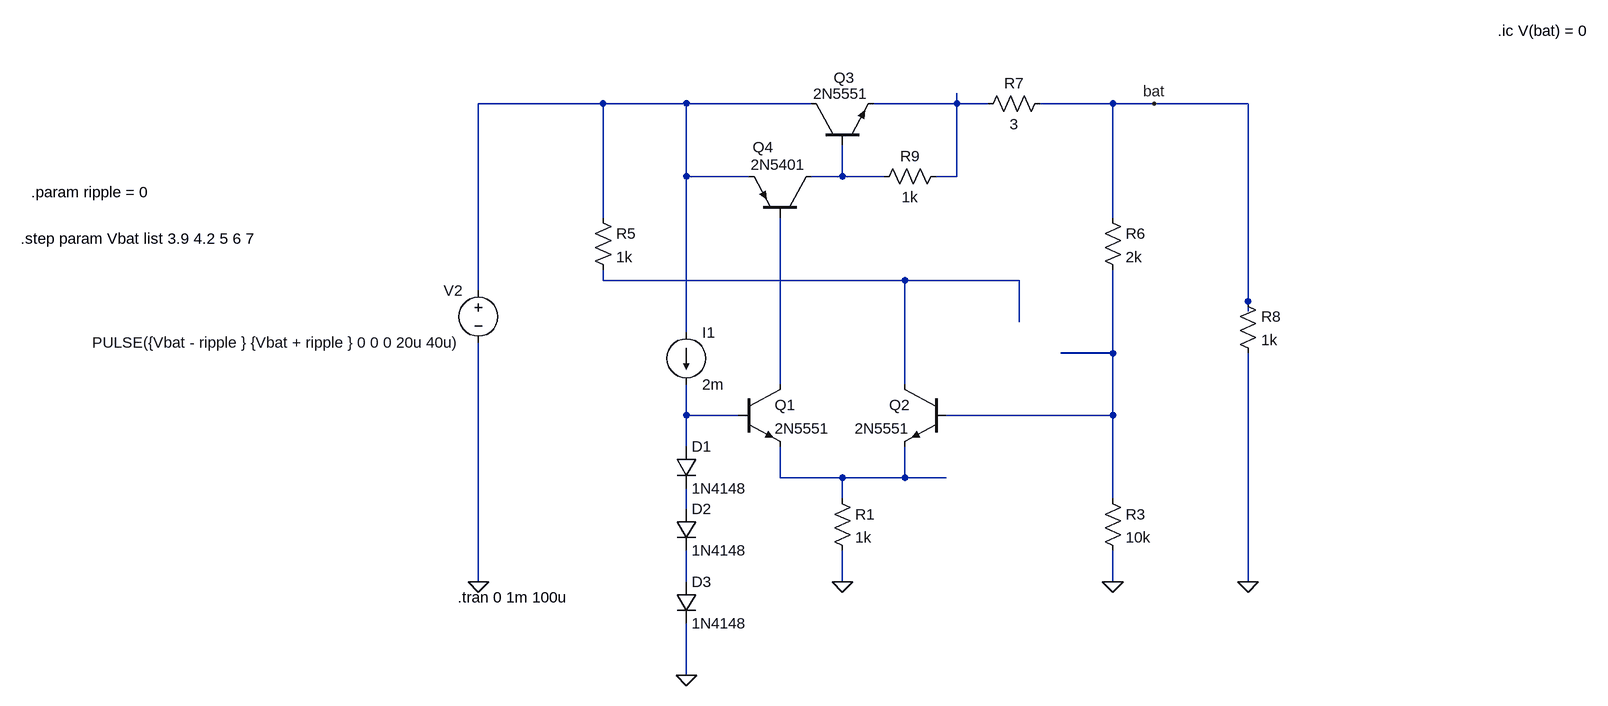
[diagram p0: schematic lin.asc]
lin.asc, the LTspice schematic file:
Version 4
SHEET 1 1420 740
WIRE -112 -160 -304 -160
WIRE 16 -160 -112 -160
WIRE 208 -160 16 -160
WIRE 432 -160 432 -176
WIRE 432 -160 304 -160
WIRE 480 -160 432 -160
WIRE 672 -160 560 -160
WIRE 736 -160 672 -160
WIRE 880 -160 736 -160
WIRE 16 -48 16 -160
WIRE 112 -48 16 -48
WIRE 256 -48 256 -96
WIRE 256 -48 208 -48
WIRE 320 -48 256 -48
WIRE 432 -48 432 -160
WIRE 432 -48 400 -48
WIRE -112 16 -112 -160
WIRE 672 16 672 -160
WIRE -112 112 -112 96
WIRE 352 112 -112 112
WIRE 528 112 352 112
WIRE -304 128 -304 -160
WIRE 880 144 880 -160
WIRE 880 160 880 144
WIRE 528 176 528 112
WIRE 16 192 16 -48
WIRE 672 224 672 96
WIRE 672 224 592 224
WIRE 160 272 160 16
WIRE 352 272 352 112
WIRE 16 320 16 272
WIRE 96 320 16 320
WIRE 672 320 672 224
WIRE 672 320 416 320
WIRE 16 368 16 320
WIRE 160 416 160 368
WIRE 256 416 160 416
WIRE 352 416 352 368
WIRE 352 416 256 416
WIRE 416 416 352 416
WIRE 256 448 256 416
WIRE 672 448 672 320
WIRE 16 464 16 432
WIRE -304 576 -304 208
WIRE 16 576 16 528
WIRE 256 576 256 528
WIRE 672 576 672 528
WIRE 880 576 880 224
WIRE 16 720 16 640
WIRE 32 720 16 720
FLAG 16 720 0
FLAG 256 576 0
FLAG 672 576 0
FLAG 880 576 0
FLAG -304 576 0
FLAG 736 -160 bat
SYMBOL npn 96 272 R0
SYMATTR InstName Q1
SYMATTR Value 2N5551
SYMBOL npn 416 272 M0
SYMATTR InstName Q2
SYMATTR Value 2N5551
SYMBOL res 240 432 R0
SYMATTR InstName R1
SYMATTR Value 1k
SYMBOL res 656 432 R0
SYMATTR InstName R3
SYMATTR Value 10k
SYMBOL npn 208 -96 R270
WINDOW 0 104 35 VRight 2
WINDOW 3 79 3 VRight 2
SYMATTR InstName Q3
SYMATTR Value 2N5551
SYMBOL pnp 208 16 M270
WINDOW 0 109 90 VLeft 2
WINDOW 3 82 93 VLeft 2
SYMATTR InstName Q4
SYMATTR Value 2N5401
SYMBOL res -128 0 R0
SYMATTR InstName R5
SYMATTR Value 1k
SYMBOL res 656 0 R0
SYMATTR InstName R6
SYMATTR Value 2k
SYMBOL res 464 -144 R270
WINDOW 0 32 56 VTop 2
WINDOW 3 0 56 VBottom 2
SYMATTR InstName R7
SYMATTR Value 3
SYMBOL diode 0 368 R0
SYMATTR InstName D1
SYMATTR Value 1N4148
SYMBOL diode 0 464 R0
SYMATTR InstName D2
SYMATTR Value 1N4148
SYMBOL res 864 128 R0
SYMATTR InstName R8
SYMATTR Value 1k
SYMBOL voltage -304 112 M0
WINDOW 123 0 0 Left 0
WINDOW 39 0 0 Left 0
SYMATTR InstName V2
SYMATTR Value PULSE({Vbat - ripple } {Vbat + ripple } 0 0 0 20u 40u)
SYMBOL res 304 -32 R270
WINDOW 0 32 56 VTop 2
WINDOW 3 0 56 VBottom 2
SYMATTR InstName R9
SYMATTR Value 1k
SYMBOL diode 0 576 R0
SYMATTR InstName D3
SYMATTR Value 1N4148
SYMBOL current 16 192 R0
WINDOW 123 0 0 Left 0
WINDOW 39 0 0 Left 0
SYMATTR InstName I1
SYMATTR Value 2m
TEXT -336 600 Left 2 !.tran 0 1m 100u
TEXT 1264 -272 Left 2 !.ic V(bat) = 0
TEXT -1008 48 Left 2 !.step param Vbat list 3.9 4.2 5 6 7
TEXT -992 -24 Left 2 !.param ripple = 0

The netlist it stands for:
* lin.asc
Q1 N006 N007 N008 0 2N5551
Q2 N004 N005 N008 0 2N5551
R1 N008 0 1k
R3 N005 0 10k
Q3 N001 N003 N002 0 2N5551
Q4 N003 N006 N001 0 2N5401
R5 N001 N004 1k
R6 bat N005 2k
R7 N002 bat 3
D1 N007 N009 1N4148
D2 N009 N010 1N4148
R8 bat 0 1k
V2 N001 0 PULSE({Vbat - ripple } {Vbat + ripple } 0 0 0 20u 40u)
R9 N003 N002 1k
D3 N010 0 1N4148
I1 N001 N007 2m
.model D D
.lib standard.dio
.model NPN NPN
.model PNP PNP
.lib standard.bjt
.tran 0 1m 100u
.ic V(bat) = 0
.step param Vbat list 3.9 4.2 5 6 7
.param ripple = 0
.backanno
.end